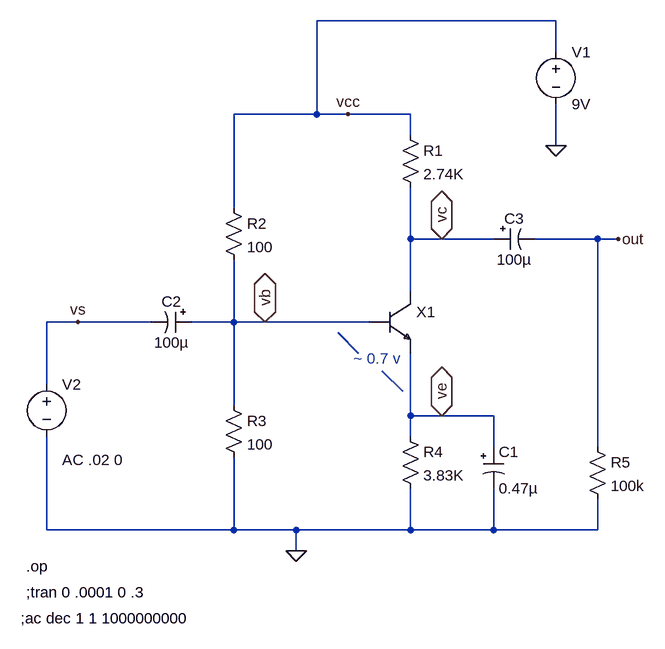
[diagram p0: schematic CEtesting circuit2.asc]
CEtesting circuit2.asc, the LTspice schematic file:
Version 4
SHEET 1 1748 680
WIRE 64 -288 -304 -288
WIRE 64 -240 64 -288
WIRE -304 -144 -304 -288
WIRE -304 -144 -432 -144
WIRE -256 -144 -304 -144
WIRE -160 -144 -256 -144
WIRE -160 -112 -160 -144
WIRE 64 -96 64 -160
WIRE -432 0 -432 -144
WIRE -160 48 -160 -32
WIRE -112 48 -160 48
WIRE -32 48 -112 48
WIRE 128 48 32 48
WIRE 160 48 128 48
WIRE -160 128 -160 48
WIRE -672 176 -720 176
WIRE -560 176 -672 176
WIRE -432 176 -432 80
WIRE -432 176 -496 176
WIRE -384 176 -432 176
WIRE -224 176 -384 176
WIRE -240 224 -272 192
WIRE -720 272 -720 176
WIRE -432 304 -432 176
WIRE -160 320 -160 224
WIRE -112 320 -160 320
WIRE -32 320 -112 320
WIRE -160 352 -160 320
WIRE -32 368 -32 320
WIRE 128 368 128 48
WIRE -720 496 -720 352
WIRE -432 496 -432 384
WIRE -432 496 -720 496
WIRE -336 496 -432 496
WIRE -160 496 -160 432
WIRE -160 496 -336 496
WIRE -32 496 -32 432
WIRE -32 496 -160 496
WIRE 128 496 128 448
WIRE 128 496 -32 496
WIRE -336 528 -336 496
FLAG 64 -96 0
FLAG -336 528 0
FLAG -384 176 vb
IOPIN -384 176 BiDir
FLAG -112 48 vc
IOPIN -112 48 BiDir
FLAG -112 320 ve
IOPIN -112 320 BiDir
FLAG -672 176 vs
FLAG 160 48 out
FLAG -256 -144 vcc
SYMBOL res -176 -128 R0
SYMATTR InstName R1
SYMATTR Value 2.74K
SYMATTR SpiceLine tol=1 pwr=0.1
SYMBOL res -448 -16 R0
SYMATTR InstName R2
SYMATTR Value 100
SYMATTR SpiceLine tol=1 pwr=0.1
SYMBOL res -448 288 R0
SYMATTR InstName R3
SYMATTR Value 100
SYMATTR SpiceLine tol=1 pwr=0.1
SYMBOL res -176 336 R0
SYMATTR InstName R4
SYMATTR Value 3.83K
SYMATTR SpiceLine tol=1 pwr=0.1
SYMBOL polcap -48 368 R0
WINDOW 3 24 64 Left 0
SYMATTR Value 0.47µ
SYMATTR InstName C1
SYMATTR Description Capacitor
SYMATTR Type cap
SYMATTR SpiceLine V=50 Irms=22m Rser=3.9 MTBF=2000 Lser=0 mfg="Nichicon" pn="UPL1HR47MAH" type="Al electrolytic" ppPkg=1
SYMBOL polcap -496 160 R90
WINDOW 0 0 32 VBottom 0
WINDOW 3 32 32 VTop 0
SYMATTR InstName C2
SYMATTR Value 100µ
SYMATTR Description Capacitor
SYMATTR Type cap
SYMATTR SpiceLine V=10 Irms=3.2 Rser=0.018 MTBF=0 Lser=0 mfg="KEMET" pn="T520D107M010ASE018" type="Tantalum" ppPkg=1
SYMBOL voltage 64 -256 R0
WINDOW 123 0 0 Left 0
WINDOW 39 0 0 Left 0
SYMATTR InstName V1
SYMATTR Value 9V
SYMBOL voltage -720 256 R0
WINDOW 3 24 160 Left 0
WINDOW 123 24 132 Left 0
WINDOW 39 0 0 Left 0
SYMATTR Value ""
SYMATTR Value2 AC .02 0
SYMATTR InstName V2
SYMBOL polcap -32 32 M90
WINDOW 0 0 32 VBottom 0
WINDOW 3 32 32 VTop 0
SYMATTR InstName C3
SYMATTR Value 100µ
SYMATTR Description Capacitor
SYMATTR Type cap
SYMATTR SpiceLine V=10 Irms=1.4 Rser=0.08 MTBF=0 Lser=0 mfg="KEMET" pn="T520D107M010ASE080" type="Tantalum" ppPkg=1
SYMBOL res 112 352 R0
SYMATTR InstName R5
SYMATTR Value 100k
SYMBOL 2n3908 -176 176 R0
SYMATTR InstName X1
TEXT -248 232 Left 0 ;~ 0.7 v
TEXT -752 552 Left 0 !.op
TEXT -760 632 Left 0 !;ac dec 1 1 1000000000
TEXT -752 592 Left 0 !;tran 0 .0001 0 .3
LINE Normal -172 283 -204 251

The netlist it stands for:
* CEtesting circuit2.asc
R1 vcc vc 2.74K tol=1 pwr=0.1
R2 vcc vb 100 tol=1 pwr=0.1
R3 vb 0 100 tol=1 pwr=0.1
R4 ve 0 3.83K tol=1 pwr=0.1
C1 ve 0 0.47µ V=50 Irms=22m Rser=3.9 MTBF=2000 Lser=0 mfg="Nichicon" pn="UPL1HR47MAH" type="Al electrolytic" ppPkg=1
C2 vb vs 100µ V=10 Irms=3.2 Rser=0.018 MTBF=0 Lser=0 mfg="KEMET" pn="T520D107M010ASE018" type="Tantalum" ppPkg=1
V1 vcc 0 9V
V2 vs 0 AC .02 0
C3 vc out 100µ V=10 Irms=1.4 Rser=0.08 MTBF=0 Lser=0 mfg="KEMET" pn="T520D107M010ASE080" type="Tantalum" ppPkg=1
R5 out 0 100k
XX1 vc vb ve 2n3908  ; pins collector base emitter
* ~ 0.7 v
.op
;ac dec 1 1 1000000000
;tran 0 .0001 0 .3
.backanno
.end